# Altium schematic sheet PCIE.SchDoc
size 190 x 279 mm
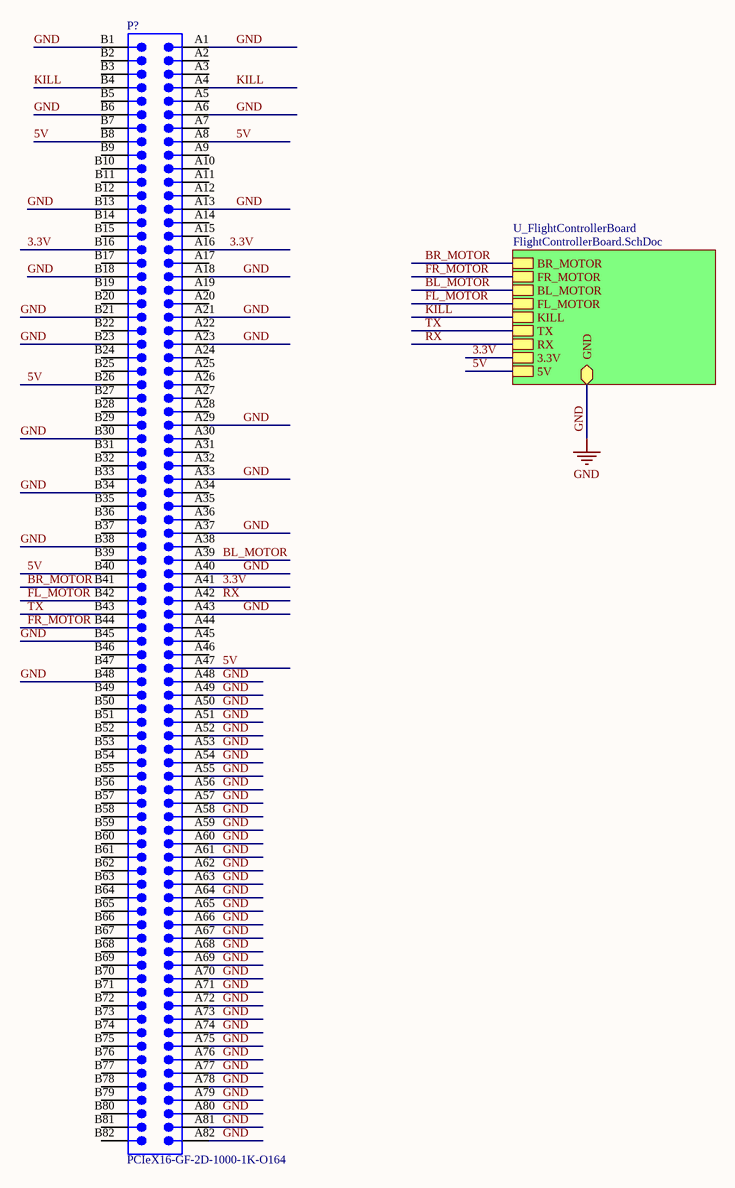
[diagram p0: PCIE.SchDoc]

## Parts
P?  PCIeX16-GF-2D-1000-1K-O164  [PCIeX16-GF-2D-1000-1K-O164]  (no BOM)

## Sub-sheets
U_FlightControllerBoard = FlightControllerBoard.SchDoc: BR_MOTOR, FR_MOTOR, BL_MOTOR, FL_MOTOR, KILL, TX, RX, 3.3V, 5V, GND

## Nets
GND: P?.A1 P?.A6 P?.A13 P?.A18 P?.A21 P?.A23 P?.A29 P?.A33 P?.A37 P?.A40 P?.A43 P?.A48 P?.A49 P?.A50 P?.A51 P?.A52 P?.A53 P?.A54 P?.A55 P?.A56 P?.A57 P?.A58 P?.A59 P?.A60 P?.A61 P?.A62 P?.A63 P?.A64 P?.A65 P?.A66 P?.A67 P?.A68 P?.A69 P?.A70 P?.A71 P?.A72 P?.A73 P?.A74 P?.A75 P?.A76 P?.A77 P?.A78 P?.A79 P?.A80 P?.A81 P?.A82 P?.B1 P?.B6 P?.B13 P?.B18 P?.B21 P?.B23 P?.B30 P?.B34 P?.B38 P?.B45 P?.B48 ; sheet U_FlightControllerBoard/GND
3.3V: P?.A16 P?.A41 P?.B16 ; sheet U_FlightControllerBoard/3.3V
5V: P?.A8 P?.A47 P?.B8 P?.B26 P?.B40 ; sheet U_FlightControllerBoard/5V
BL_MOTOR: P?.A39 ; sheet U_FlightControllerBoard/BL_MOTOR
BR_MOTOR: P?.B41 ; sheet U_FlightControllerBoard/BR_MOTOR
FL_MOTOR: P?.B42 ; sheet U_FlightControllerBoard/FL_MOTOR
FR_MOTOR: P?.B44 ; sheet U_FlightControllerBoard/FR_MOTOR
KILL: P?.A4 P?.B4 ; sheet U_FlightControllerBoard/KILL
RX: P?.A42 ; sheet U_FlightControllerBoard/RX
TX: P?.B43 ; sheet U_FlightControllerBoard/TX

Not connected (* = marked no-connect by the designer): P? A2 A3 A5 A7 A9 A10 A11 A12 A14 A15 A17 A19 A20 A22 A24 A25 A26 A27 A28 A30 A31 A32 A34 A35 A36 A38 A44 A45 A46 B2 B3 B5 B7 B9 B10 B11 B12 B14 B15 B17 B19 B20 B22 B24 B25 B27 B28 B29 B31 B32 B33 B35 B36 B37 B39 B46 B47 B49 B50 B51 B52 B53 B54 B55 B56 B57 B58 B59 B60 B61 B62 B63 B64 B65 B66 B67 B68 B69 B70 B71 B72 B73 B74 B75 B76 B77 B78 B79 B80 B81 B82

## Library data of the parts
P? = CMP-0001-00033-2: Golden finger, PCIeX16, Dual, Opposite, Pitch 1mm, 164-Position; Mating Connector: Molex-87715-9305; Package Reference: PCIeX16-GF-2D-1000-1K-O164; Publisher: Altium; Datasheet Version: rev2.0, Apr-2007; ClassName: Edge Connector